# EAGLE design mainboard (EAGLE 9.5.2)
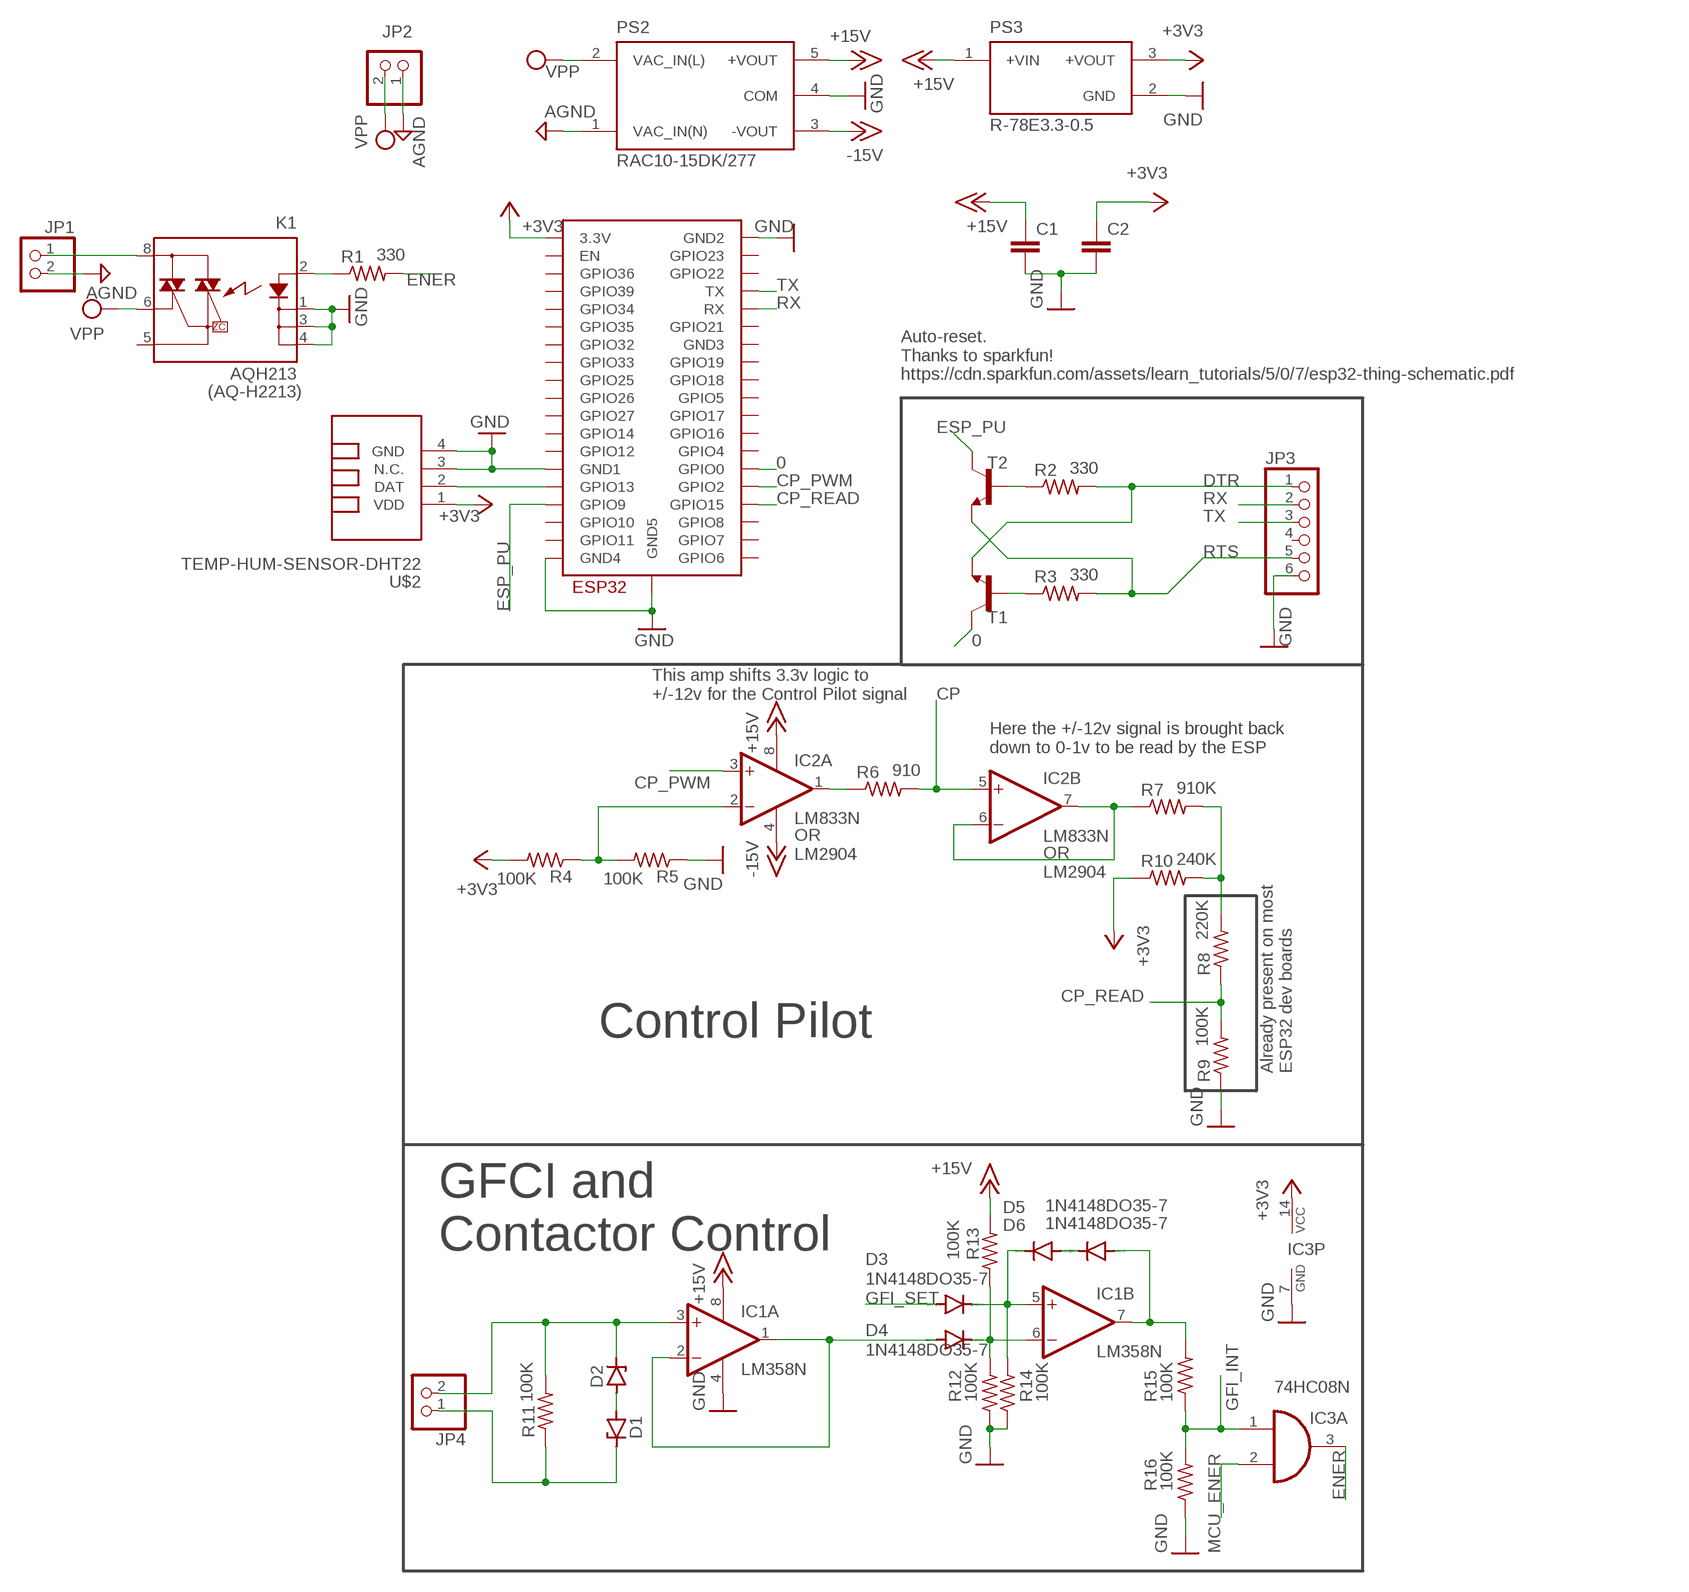
[diagram p0: schematic, sheet 1]

## Parts
C1  C-EU025-025X050  [C025-025X050]
C2  C-EU025-025X050  [C025-025X050]
D1  ZENER-DIODEDO34-7  [DO34Z7]
D2  ZENER-DIODEDO34-7  [DO34Z7]
D3  1N4148DO35-7  [DO35-7]
D4  1N4148DO35-7  [DO35-7]
D5  1N4148DO35-7  [DO35-7]
D6  1N4148DO35-7  [DO35-7]
IC1  LM358N  [DIL08]
IC2  LM833N  [DIL08]
IC3  74HC08N  [DIL14]
JP1  PINHD-1X2  [1X02]
JP2  PINHD-1X2  [1X02]
JP3  PINHD-1X6  [1X06]
JP4  PINHD-1X2  [1X02]
K1  AQH213  [DIL07]
PS2  RAC10-15DK/277  [CONV_RAC10-15DK/277]
PS3  R-78E3.3-0.5  [CONV_R-78E3.3-0.5]
R1  330  R-US_0204/7  [0204/7]
R2  330  R-US_0204/7  [0204/7]
R3  330  R-US_0204/7  [0204/7]
R4  100K  R-US_0204/7  [0204/7]
R5  100K  R-US_0204/7  [0204/7]
R6  910  R-US_0204/7  [0204/7]
R7  910K  R-US_0204/7  [0204/7]
R8  220K  R-US_0204/7  [0204/7]
R9  100K  R-US_0204/7  [0204/7]
R10  240K  R-US_0204/7  [0204/7]
R11  100K  R-US_0204/7  [0204/7]
R12  100K  R-US_0204/7  [0204/7]
R13  100K  R-US_0204/7  [0204/7]
R14  100K  R-US_0204/7  [0204/7]
R15  100K  R-US_0204/7  [0204/7]
R16  100K  R-US_0204/7  [0204/7]
T1  MMBT3904LT1-NPN-SOT23-BEC  [SOT23-BEC]
T2  MMBT3904LT1-NPN-SOT23-BEC  [SOT23-BEC]
U$1  ESP32-WROOM  [ESP32-WROOM]
U$2  TEMP-HUM-SENSOR-DHT22  [TEMP-HUM-SENSOR-DHT22]

## Nets
0: T1.C U$1.IO0(GPIO0)
+3V3: C2.1 IC3.14(P:VCC) PS3.3(+VOUT) R4.2 R10.1 U$1.3V3(3.3V) U$2.1(VDD)
+15V: C1.1 IC1.8(P:V+) IC2.8(P:V+) PS2.5(+VOUT) PS3.1(+VIN) R13.2
-15V: IC2.4(P:V-) PS2.3(-VOUT)
AGND: JP1.2 JP2.1 PS2.1(VAC_IN(N))
CP: IC2.5(B:+IN) R6.2
CP_PWM: IC2.3(A:+IN) U$1.IO2(GPIO2)
CP_READ: R8.1 R9.2 U$1.IO15(GPIO15)
DTR: JP3.1 R2.2 T1.E
ENER: IC3.3(A:O) R1.2
ESP_PU: T2.C U$1.SD2(GPIO9)
GFI_INT: IC3.1(A:I0) R15.1 R16.2
GFI_SET: D3.A
GND: C1.2 C2.2 IC1.4(P:V-) IC3.7(P:GND) JP3.6 K1.1(K) K1.3(K1) K1.4(K2) PS2.4(COM) PS3.2(GND) R5.1 R9.1 R12.1 R14.1 R16.1 U$1.GND1 U$1.GND2 U$1.GND4 U$1.GND5 U$2.3(N.C.) U$2.4(GND)
MCU_ENER: IC3.2(A:I1)
N$1: K1.2(A) R1.1
N$3: JP1.1 K1.8(DS1)
N$4: U$1.IO13(GPIO13) U$2.2(DAT)
N$5: D1.A D2.A
N$6: D2.C IC1.3(A:+IN) JP4.2 R11.2
N$7: R2.1 T2.B
N$8: R3.1 T1.B
N$9: D4.A IC1.1(A:OUT) IC1.2(A:-IN)
N$10: D1.C JP4.1 R11.1
N$11: D6.A IC1.7(B:OUT) R15.2
N$12: D5.A D6.C
N$13: D3.C D5.C IC1.5(B:+IN) R14.2
N$14: D4.C IC1.6(B:-IN) R12.2 R13.1
N$15: IC2.2(A:-IN) R4.1 R5.2
N$16: IC2.1(A:OUT) R6.1
N$17: IC2.6(B:-IN) IC2.7(B:OUT) R7.1
N$18: R7.2 R8.2 R10.2
RTS: JP3.5 R3.2 T2.E
RX: JP3.2 U$1.RX
TX: JP3.3 U$1.TX
VPP: JP2.2 K1.6(DS3) PS2.2(VAC_IN(L))
Unconnected: IC3.4(B:I0) IC3.5(B:I1) IC3.6(B:O) IC3.8(C:O) IC3.9(C:I0) IC3.10(C:I1) IC3.11(D:O) IC3.12(D:I0) IC3.13(D:I1) JP3.4 K1.5(DS2) U$1.CLK(GPIO6) U$1.CMD(GPIO11) U$1.EN U$1.GND3 U$1.IO4(GPIO4) U$1.IO5(GPIO5) U$1.IO12(GPIO12) U$1.IO14(GPIO14) U$1.IO16(GPIO16) U$1.IO17(GPIO17) U$1.IO18(GPIO18) U$1.IO19(GPIO19) U$1.IO21(GPIO21) U$1.IO22(GPIO22) U$1.IO23(GPIO23) U$1.IO25(GPIO25) U$1.IO26(GPIO26) U$1.IO27(GPIO27) U$1.IO32(GPIO32) U$1.IO33(GPIO33) U$1.IO34(GPIO34) U$1.IO35(GPIO35) U$1.SD0(GPIO7) U$1.SD1(GPIO8) U$1.SD3(GPIO10) U$1.SENSOR_VN(GPIO39) U$1.SENSOR_VP(GPIO36)

## Notes on the sheet
- Auto-reset.
  Thanks to sparkfun!
  https://cdn.sparkfun.com/assets/learn_tutorials/5/0/7/esp32-thing-schematic.pdf
- (AQ-H2213)
- This amp shifts 3.3v logic to 
  +/-12v for the Control Pilot signal
- Here the +/-12v signal is brought back 
  down to 0-1v to be read by the ESP
- OR
  LM2904
- OR
  LM2904
- Control Pilot
- Already present on most 
  ESP32 dev boards
- GFCI and 
  Contactor Control

## Library data of the parts
C1 C2 = rcl:C-EU: CAPACITOR, European symbol; SPICEPREFIX: C
D1 D2 = diode:ZENER-DIODE: Z-Diode
D3-D6 = diode:1N4148: DIODE high speed (Philips)
IC1 = linear:LM358: OP AMP also LM158; LM258; LM2904 Source: http://cache.national.com/ds/LM/LM158.pdf
IC2 = linear:LM833: OP AMP
IC3 = 74xx-eu:74*08: Quad 2-input AND gate
JP1 JP2 JP4 = pinhead:PINHD-1X2: PIN HEADER
JP3 = pinhead:PINHD-1X6: PIN HEADER
K1 = relay:AQH*213: SOLID STATE RELAY NAiS Source: http://www.mew-europe.com/.. en_ds_61613_0000.pdf; OC_FARNELL: unknown; OC_NEWARK: unknown
PS2 = RAC10-15DK_277:RAC10-15DK/277: AC/DC CONVERTER 12V 10W, DUAL; DESCRIPTION: 10W AC/DC-Converter 'POWERLINE' 2x1 4kV reg; DIGI-KEY_PART_NUMBER: 945-3126-5-ND; DIGI-KEY_PURCHASE_URL: https://www.digikey.com/product-detail/en/recom-power/RAC10-15DK-277/945-3126-5-ND/7807874?utm_source=snapeda&utm_medium=aggregator&utm_campaign=symbol; MF: Recom Power; MP: RAC10-15DK/277; PACKAGE: DIP-5 Recom Power
PS3 = R-78E3.3-0.5:R-78E3.3-0.5: 0.5 Amp SIP3 Single Output; DESCRIPTION: 0.5A DC/DC-Converter 'INNOLINE' SIP3 reg; DIGI-KEY_PART_NUMBER: 945-1661-5-ND; DIGI-KEY_PURCHASE_URL: https://www.digikey.com/product-detail/en/recom-power/R-78E3.3-0.5/945-1661-5-ND/3593412?utm_source=snapeda&utm_medium=aggregator&utm_campaign=symbol; MF: Recom Power; MP: R-78E3.3-0.5; PACKAGE: SIP-3 Recom Power
R1-R16 = rcl:R-US_: RESISTOR, American symbol; SPICEPREFIX: R
T1 T2 = transistor:*-NPN-: NPN Transistror BF959 corrected 2008.03.06
U$1 = ESP32:ESP32-WROOM
U$2 = diy-modules:TEMP-HUM-SENSOR-DHT22: DHT22 - digital humidity & temperature sensor Also known as: AM2302 AM2302 datasheet available here: http://akizukidenshi.com/download/ds/aosong/AM2302.pdf Click here to find device on ebay.com <http://www.ebay.com/sch/dht22+digital+sensor>

## Board
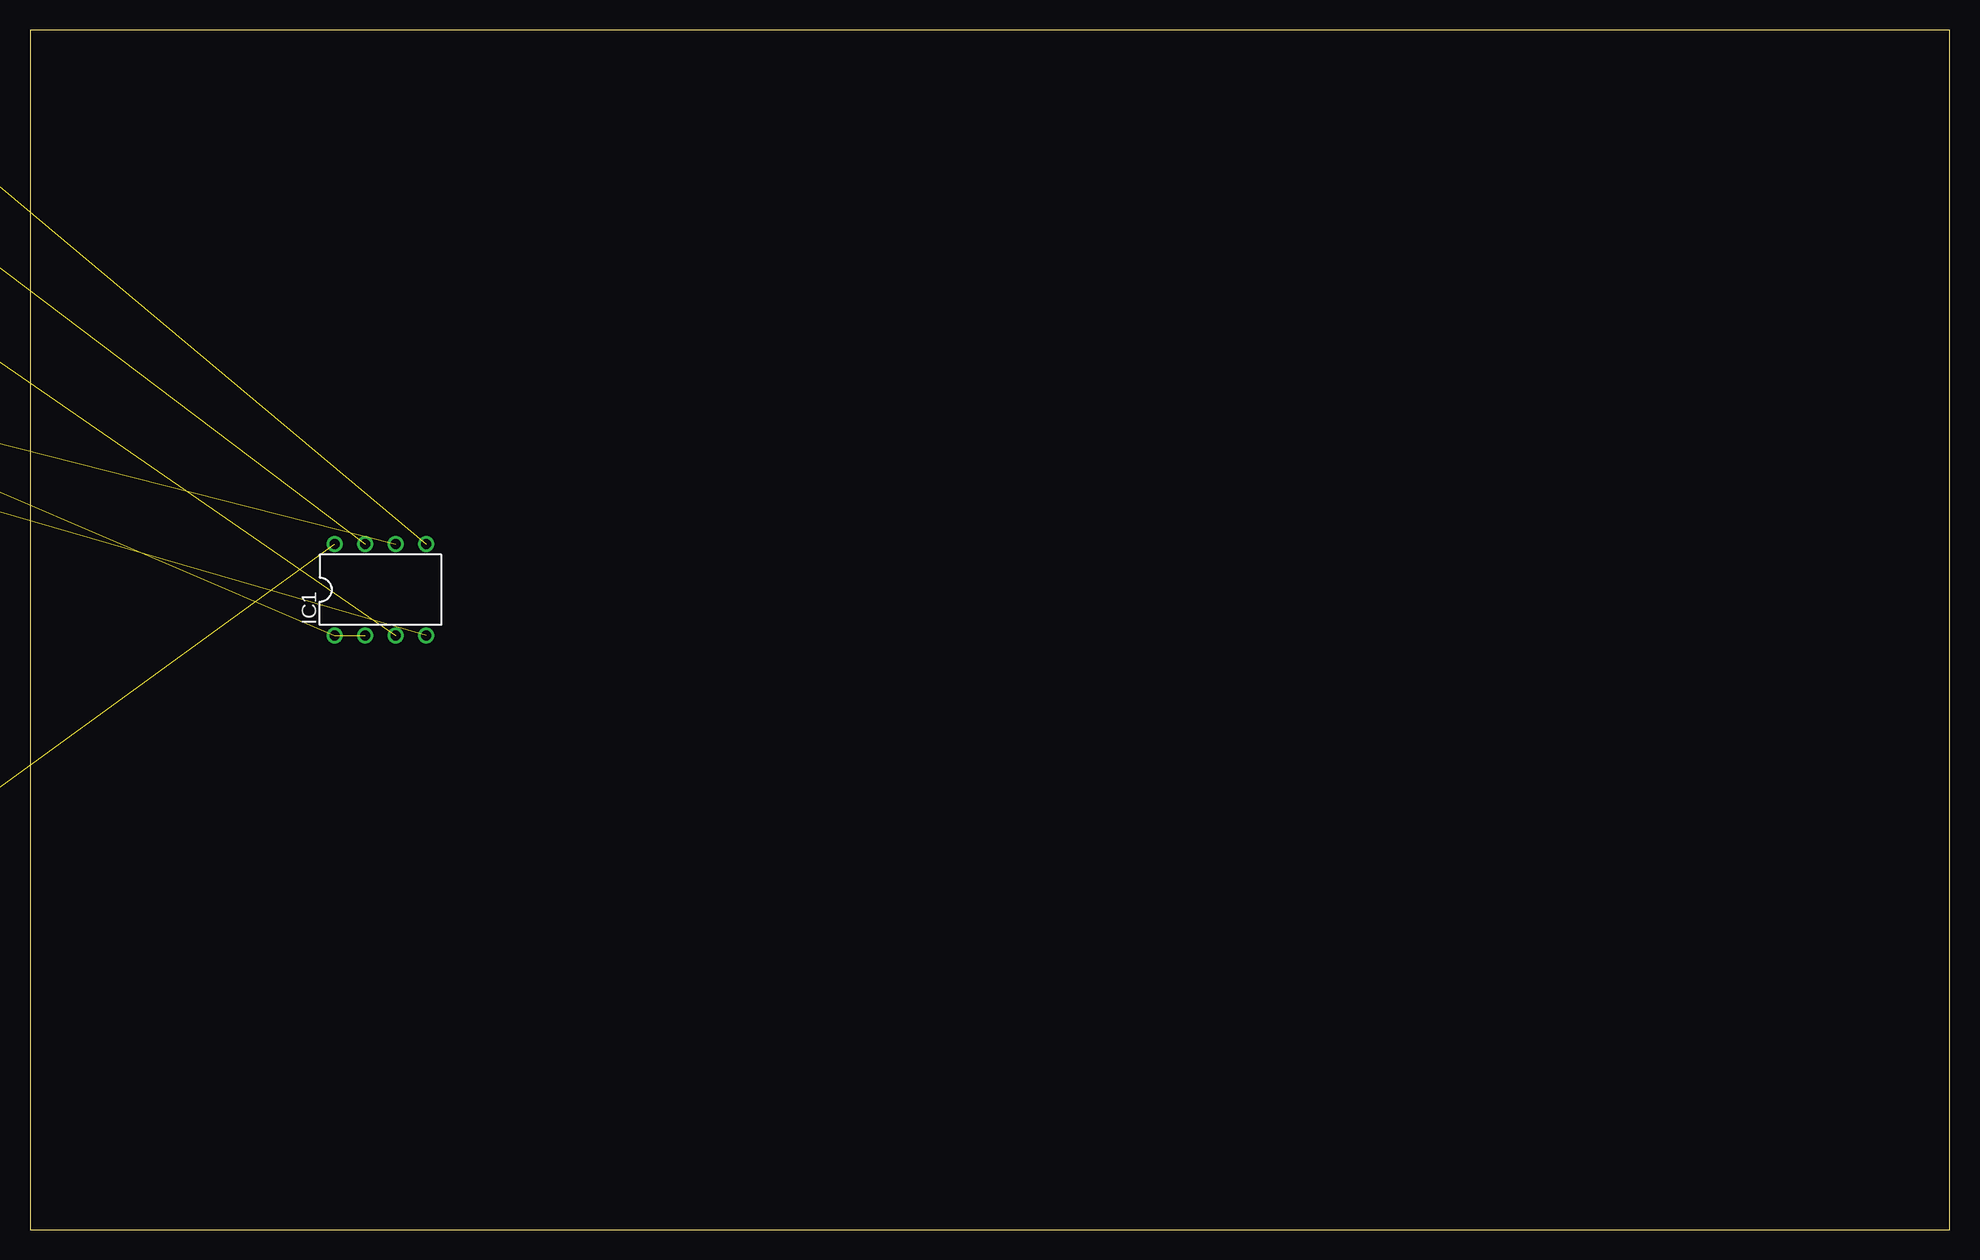
[diagram p1: board, top side]
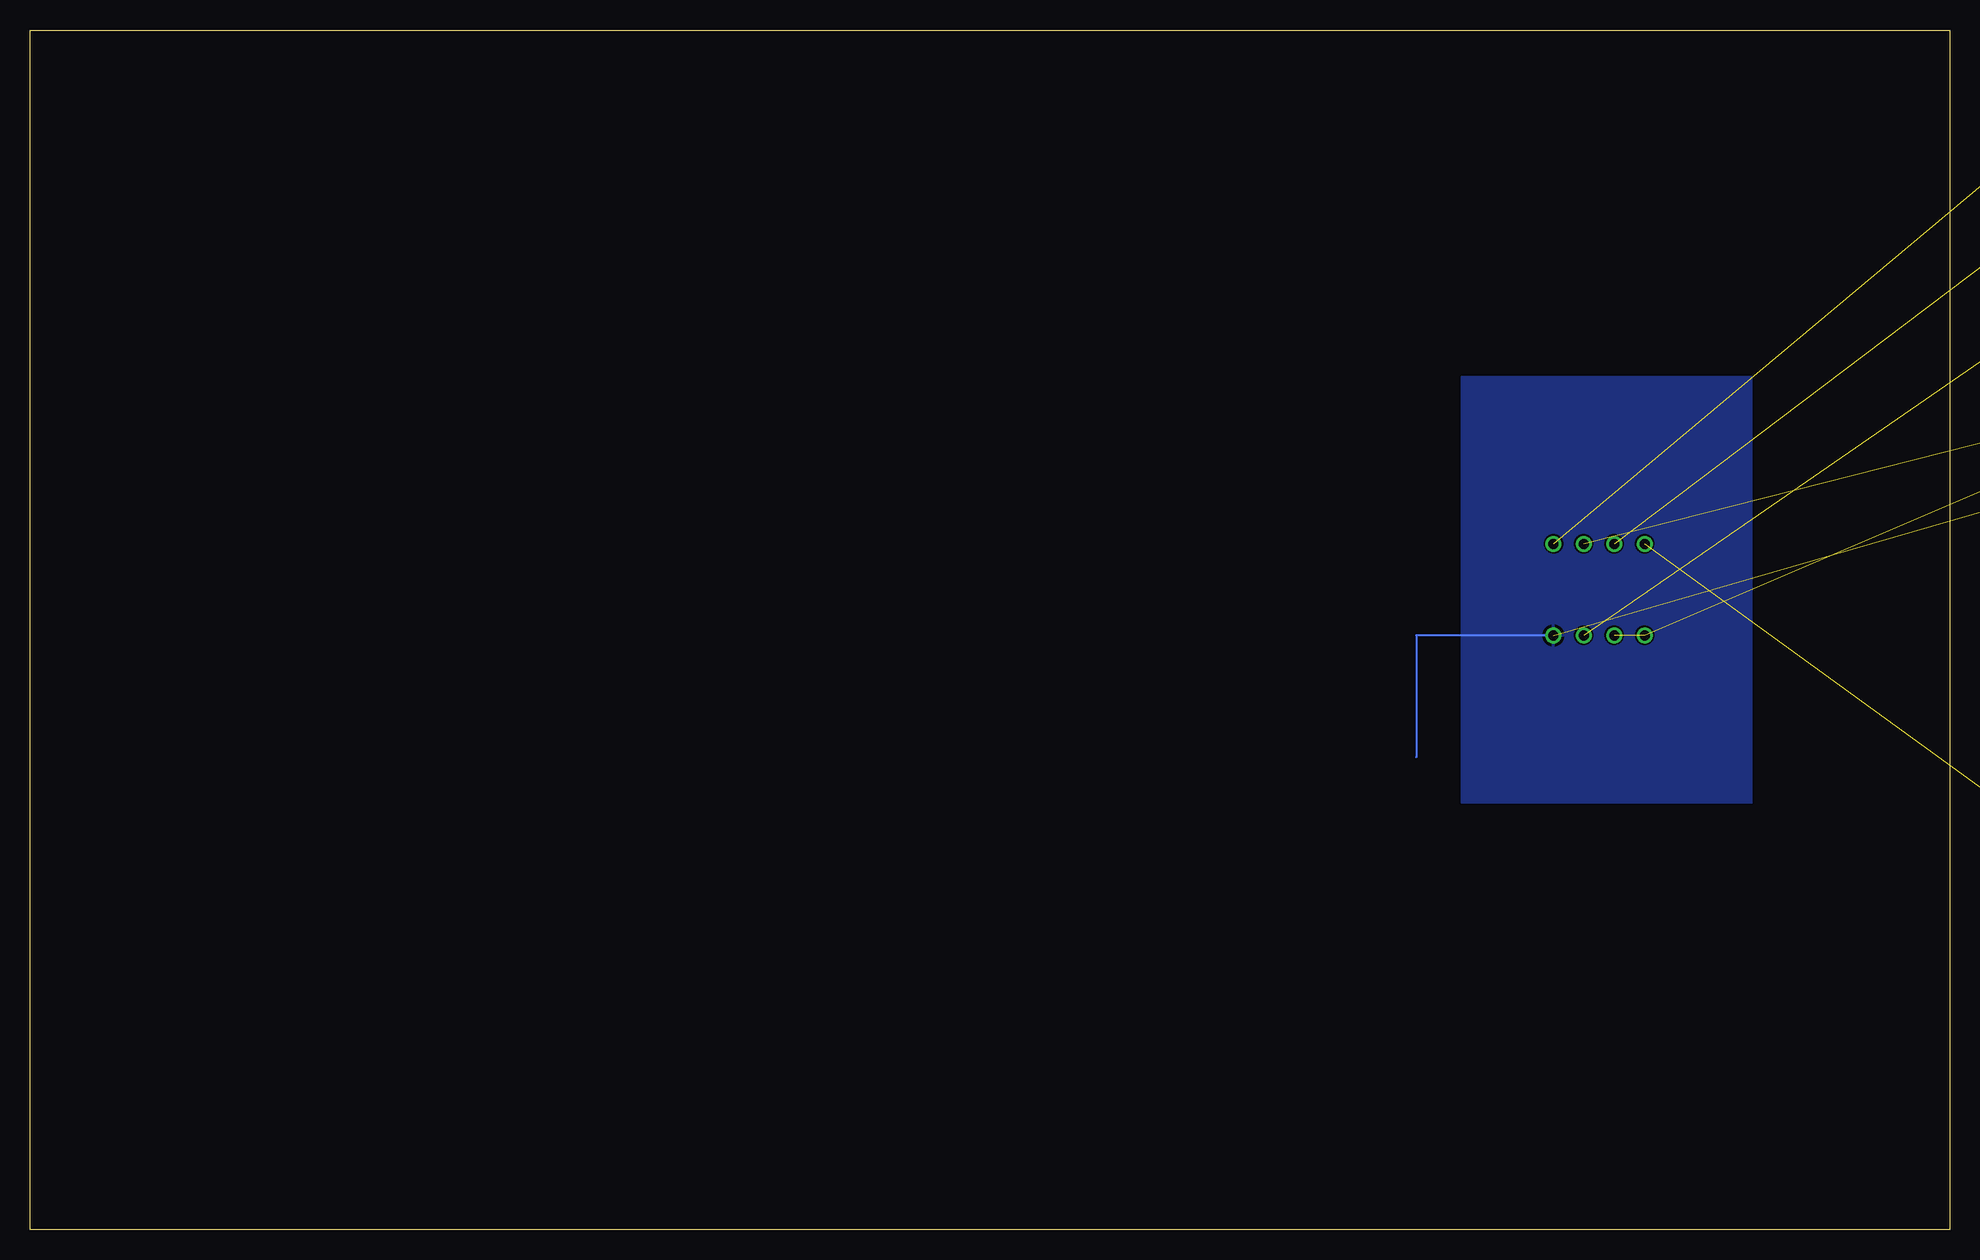
[diagram p2: board, bottom side, seen from below]

Size 160 x 100 mm. Coordinates in mm from the lower left corner, seen from the top.
Outline: 0,0 160,0 160,100 0,100 0,0
Copper layers (1*16): Top 0.035mm / dielectric 1.5mm / Bottom 0.035mm
Design rules "default": minimum track width 6mil, minimum drill 0.35mm, track to track 6mil, track to pad 6mil, pad to pad 6mil, via to via 6mil, smd to smd 6mil, copper to edge 40mil, drill to drill 6mil, minimum pad ring 10mil, minimum via ring 8mil, stop-mask expansion 4mil, vias tented up to drill 0mil, thermal gap 10mil

### Footprints (pad centres in the part's own frame; a part is rotated, then mirrored left to right if it is on the bottom)
C025-025X050 = drill 0.813 octagon: 1 -1.27,0; 2 1.27,0
DO34Z7 = drill 0.813 long: A 3.81,0; C -3.81,0
DO35-7 = drill 0.813 long: A 3.81,0; C -3.81,0
DIL08 = drill 0.813 pad 1.27: 1 -3.81,-3.81; 2 -1.27,-3.81; 3 1.27,-3.81; 4 3.81,-3.81; 5 3.81,3.81; 6 1.27,3.81; 7 -1.27,3.81; 8 -3.81,3.81
DIL14 = drill 0.813 long: 1 -7.62,-3.81; 2 -5.08,-3.81; 3 -2.54,-3.81; 4 0,-3.81; 5 2.54,-3.81; 6 5.08,-3.81; 7 7.62,-3.81; 8 7.62,3.81; 9 5.08,3.81; 10 2.54,3.81; 11 0,3.81; 12 -2.54,3.81; 13 -5.08,3.81; 14 -7.62,3.81
1X02 = drill 1.016 long: 1 -1.27,0; 2 1.27,0
1X06 = drill 1.016 long: 1 -6.35,0; 2 -3.81,0; 3 -1.27,0; 4 1.27,0; 5 3.81,0; 6 6.35,0
DIL07 = drill 0.8 long: 1 -3.81,-3.81; 2 -1.27,-3.81; 3 1.27,-3.81; 4 3.81,-3.81; 5 3.81,3.81; 6 1.27,3.81; 8 -3.81,3.81
CONV_RAC10-15DK/277 = drill 1.35 pad 2.03 square: 1 -22.86,10.2 | drill 1.35 pad 2.03: 2 -22.86,-10.12; 3 22.86,-10.12; 4 22.86,0.04; 5 22.86,10.2
CONV_R-78E3.3-0.5 = drill 1 square: 1 -2.54,-2.25 | drill 1: 2 0,-2.25; 3 2.54,-2.25
0204/7 = drill 0.813 octagon: 1 -3.81,0; 2 3.81,0
SOT23-BEC = smd 1 x 1.4: B -0.95,-1.1; C 0,1.1; E 0.95,-1.1
ESP32-WROOM = smd 3 x 0.9: 3V3 0,16.74; EN 0,15.47; GND1 0,18.01; GND3 18,18.01; IO0 18,1.5; IO4 18,2.77; IO5 18,6.58; IO12 0,1.5; IO14 0,2.77; IO16 18,4.04; IO17 18,5.31; IO18 18,7.85; IO19 18,9.12; IO21 18,11.66; IO22 18,15.47; IO23 18,16.74; IO25 0,6.58; IO26 0,5.31; IO27 0,4.04; IO32 0,9.12; IO33 0,7.85; IO34 0,11.66; IO35 0,10.39; NC 18,10.39; RX 18,12.93; SENSOR_VN 0,12.93; SENSOR_VP 0,14.2; TX 18,14.2 | smd 0.9 x 3: CLK 9.635,0; CMD 8.365,0; GND2 3.285,0; IO2 14.715,0; IO13 4.555,0; IO15 13.445,0; SD0 10.905,0; SD1 12.175,0; SD2 5.825,0; SD3 7.095,0 | smd 5 x 5: GND4 8,10.5 | smd 5 x 5 bottom: GND5 8,10.5
TEMP-HUM-SENSOR-DHT22 = drill 0.8 square: 1 -3.81,0 | drill 0.8: 2 -1.27,0; 3 1.27,0; 4 3.81,0

### Placement (x,y rotation side)
C1  -55.88,81.28 0 top  (outside the outline)
C2  -62.23,81.28 0 top  (outside the outline)
D1  -71.12,81.28 0 top  (outside the outline)
D2  -19.05,86.36 0 top  (outside the outline)
D3  -24.13,76.2 0 top  (outside the outline)
D4  -40.64,76.2 0 top  (outside the outline)
D5  -57.15,76.2 0 top  (outside the outline)
D6  -73.66,76.2 0 top  (outside the outline)
IC1  29.21,53.34 0 top
IC2  -69.85,66.04 0 top  (outside the outline)
IC3  -22.86,67.31 0 top  (outside the outline)
JP1  -36.83,81.28 0 top  (outside the outline)
JP2  -43.18,81.28 0 top  (outside the outline)
JP3  -25.4,81.28 0 top  (outside the outline)
JP4  -49.53,81.28 0 top  (outside the outline)
K1  -43.18,67.31 0 top  (outside the outline)
PS2  -39.37,16.51 0 top  (outside the outline)
PS3  -67.31,40.64 0 top  (outside the outline)
R1  -29.21,86.36 0 top  (outside the outline)
R2  -39.37,86.36 0 top  (outside the outline)
R3  -49.53,86.36 0 top  (outside the outline)
R4  -59.69,86.36 0 top  (outside the outline)
R5  -69.85,86.36 0 top  (outside the outline)
R6  -80.01,86.36 0 top  (outside the outline)
R7  -17.78,91.44 0 top  (outside the outline)
R8  -27.94,91.44 0 top  (outside the outline)
R9  -38.1,91.44 0 top  (outside the outline)
R10  -48.26,91.44 0 top  (outside the outline)
R11  -58.42,91.44 0 top  (outside the outline)
R12  -68.58,91.44 0 top  (outside the outline)
R13  -78.74,91.44 0 top  (outside the outline)
R14  -17.78,96.52 0 top  (outside the outline)
R15  -27.94,96.52 0 top  (outside the outline)
R16  -38.1,96.52 0 top  (outside the outline)
T1  -81.28,74.93 0 top  (outside the outline)
T2  -15.24,81.28 0 top  (outside the outline)
U$1  -33.02,35.56 0 top  (outside the outline)
U$2  -48.26,41.91 0 top  (outside the outline)

### Tracks (layer width: path | path; a pad name or v marks a point on that pad's centre or on a via)
0  (1 unrouted)
+3V3  (6 unrouted)
+15V  (5 unrouted)
-15V  (1 unrouted)
AGND  (2 unrouted)
CP  (1 unrouted)
CP_PWM  (1 unrouted)
CP_READ  (2 unrouted)
DTR  (2 unrouted)
ENER  (1 unrouted)
ESP_PU  (1 unrouted)
GFI_INT  (2 unrouted)
GND  (20 unrouted)
  Bottom 0.152: IC1.4 44.45,49.53 44.45,39.37
  pour Bottom: 16.51,71.12 16.51,35.56 40.64,35.56 40.64,71.12
N$1  (1 unrouted)
N$3  (1 unrouted)
N$4  (1 unrouted)
N$5  (1 unrouted)
N$6  (3 unrouted)
N$7  (1 unrouted)
N$8  (1 unrouted)
N$9  (2 unrouted)
N$10  (2 unrouted)
N$11  (2 unrouted)
N$12  (1 unrouted)
N$13  (3 unrouted)
N$14  (3 unrouted)
N$15  (2 unrouted)
N$16  (1 unrouted)
N$17  (2 unrouted)
N$18  (2 unrouted)
RTS  (2 unrouted)
RX  (1 unrouted)
TX  (1 unrouted)
VPP  (2 unrouted)